# Altium schematic sheet Connectors.SchDoc
size 259 x 167 mm; SheetNumber: 15; SheetTotal: 15
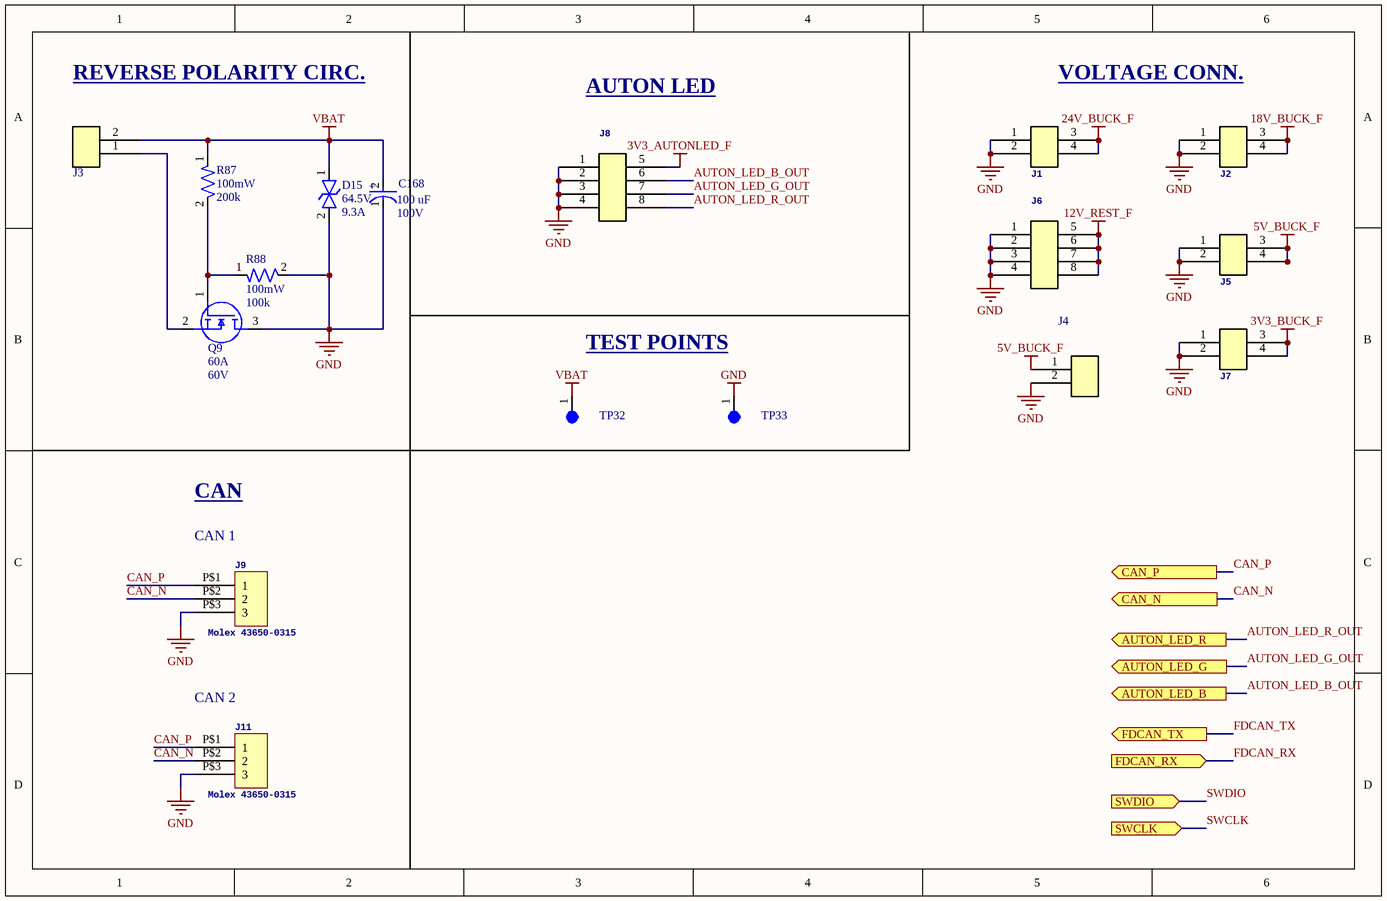
[diagram p0: Connectors.SchDoc]

## Parts
C168  Voltage: 100V  Capacitance: 100 uF  [CAP-100U-0001]  (hidden comment: EEETK2A101AM)
D15  Voltage Rating: 64.5V  Current Rating: 9.3A  [DO-214AA (SMBJ)]  (hidden comment: SMBJ40CA)
J1  Molex 43045-0412  [CONN-4POS-0002]  (value not drawn)
J2  Molex 43045-0412  [CONN-4POS-0002]  (value not drawn)
J3  1546927-2  [CONN-1546927-2]  (value not drawn)
J4  0436500215  [CONN-2POS-0002]  (value not drawn)
J5  Molex 43045-0412  [CONN-4POS-0002]  (value not drawn)
J6  Molex 43045-0812  [CONN-8POS-0001]  (value not drawn)
J7  Molex 43045-0412  [CONN-4POS-0002]  (value not drawn)
J8  Molex 43045-0812  [CONN-8POS-0001]  (value not drawn)
J9  Molex 43650-0315  [43650-0315]
J11  Molex 43650-0315  [43650-0315]
Q9  Voltage: 60V  Continuous Current: 60A  [IC-8VSONCLIP]  (hidden comment: CSD18543Q3AT)
R87  Power: 100mW  Resistance: 200k  [RES-0603]  (hidden comment: RC0603FR-07200KL)
R88  Power: 100mW  Resistance: 100k  [RES-0603]  (hidden comment: RC0603FR-07100KL)
TP32  5003  [TEST-POINT-0001]  (value not drawn)
TP33  5003  [TEST-POINT-0001]  (value not drawn)

## Ports
AUTON_LED_B (out), AUTON_LED_G (out), AUTON_LED_R (out), CAN_N (out, see CAN_Transceiver[1C]), CAN_P (out, see CAN_Transceiver[1C]), FDCAN_RX (in, see CAN_Transceiver[1C]), FDCAN_TX (out, see CAN_Transceiver[1C]), SWCLK (in), SWDIO (in)

## Nets
3V3_AUTONLED_F: J8.5
3V3_BUCK_F: J7.3 J7.4
5V_BUCK_F: J4.1 J5.3 J5.4
12V_REST_F: J6.5 J6.6 J6.7 J6.8
18V_BUCK_F: J2.3 J2.4
24V_BUCK_F: J1.3 J1.4
GND: C168.1 D15.2 J1.1 J1.2 J2.1 J2.2 J4.2 J5.1 J5.2 J6.1 J6.2 J6.3 J6.4 J7.1 J7.2 J8.1 J8.2 J8.3 J8.4 J9.P$3(3) J11.P$3(3) Q9.3(D) R88.2 TP33.1
VBAT: C168.2 D15.1 J3.2 R87.1 TP32.1
AUTON_LED_B_OUT: J8.6 ; port AUTON_LED_B
AUTON_LED_G_OUT: J8.7 ; port AUTON_LED_G
AUTON_LED_R_OUT: J8.8 ; port AUTON_LED_R
CAN_N: J9.P$2(2) J11.P$2(2) ; port CAN_N
CAN_P: J9.P$1(1) J11.P$1(1) ; port CAN_P
FDCAN_RX: port FDCAN_RX
FDCAN_TX: port FDCAN_TX
SWCLK: port SWCLK
SWDIO: port SWDIO
NetJ3_1: J3.1 Q9.2(S)
NetQ9_1: Q9.1(G) R87.2 R88.1

## Notes on the sheet
- REVERSE POLARITY CIRC.
- AUTON LED
- VOLTAGE CONN.
- TEST POINTS
- CAN
- (near J9) CAN 1
- (near J11) CAN 2
- (in symbol CAP-100U-0001) +

## Library data of the parts
C168 = CAP-100U-0001: CAP ALUM 100UF 20% 100V SMD; Device Class: Electrolytic; ComponentLink1Description: Datasheet; ComponentLink1URL: https://industrial.panasonic.com/cdbs/www-data/pdf/RDE0000/ABA0000C1190.pdf
D15 = DIO-TVS-0001: TVS DIODE 40VWM 64.5VC DO214AA; ComponentLink1Description: Datasheet; ComponentLink1URL: https://www.littelfuse.com/media?resourcetype=datasheets&itemid=09a6ae9a-73cb-4ac4-acac-e6dab92ab953&filename=littelfuse_tvs_diode_smbj_datasheet.pdf
J1 J2 J5 J7 = CONN-4POS-0002: CONN HEADER VERT 4POS 3MM; ComponentLink1Description: Datasheet; ComponentLink1URL: https://www.molex.com/content/dam/molex/molex-dot-com/products/automated/en-us/salesdrawingpdf/430/43045/430450412_sd.pdf?inline
J3 = CONN-2POS-0003
J4 = CONN-2POS-0002: CONN HEADER VERT 2POS 3MM; ComponentLink1Description: Datasheet; ComponentLink1URL: https://www.molex.com/content/dam/molex/molex-dot-com/products/automated/en-us/salesdrawingpdf/436/43650/436500215_sd.pdf?inline
J6 J8 = CONN-8POS-0001: GateName_1: G$1; SymbolName_1: HEADER_POS8; DeviceSetName: HEADER_POS8_?; DeviceName: 43045-0812; LibraryName: con-molex-micro-fit-3_0_2; Package: 43045-0812
J9 J11 = Micro-Fit Molex 3 Pin Vertical: GateName_1: G$1; SymbolName_1: HEADER_POS3; DeviceSetName: HEADER_POS3_?; DeviceName: 43650-0315; LibraryName: con-molex-micro-fit-3_0_2; Package: 43650-0315
Q9 = NMOS-60A-0001: MOSFET N-CH 60V 12A/60A 8VSON; ComponentLink2Description: Datasheet; ComponentLink2URL: http://www.ti.com/lit/ds/symlink/csd18543q3a.pdf
R87 = RES-200k-0001: RES SMD 200K OHM 1% 1/10W 0603; Tolerance: 1%; Size: 0603; ComponentLink1Description: Datasheet; ComponentLink1URL: https://www.yageo.com/upload/media/product/products/datasheet/rchip/PYu-RC_Group_51_RoHS_L_12.pdf
R88 = RES-100k-0001: RES SMD 100K OHM 1% 1/10W 0603; Tolerance: 1%; Size: 0603; ComponentLink1Description: Datasheet; ComponentLink1URL: https://www.yageo.com/upload/media/product/products/datasheet/rchip/PYu-RC_Group_51_RoHS_L_12.pdf
TP32 TP33 = TEST-POINT-0001: Oranange PC Test Point, Miniature Phoisphor Bronze Silver Plating Through Hole Mounting Type